# Altium schematic sheet 7segments.SchDoc
size A
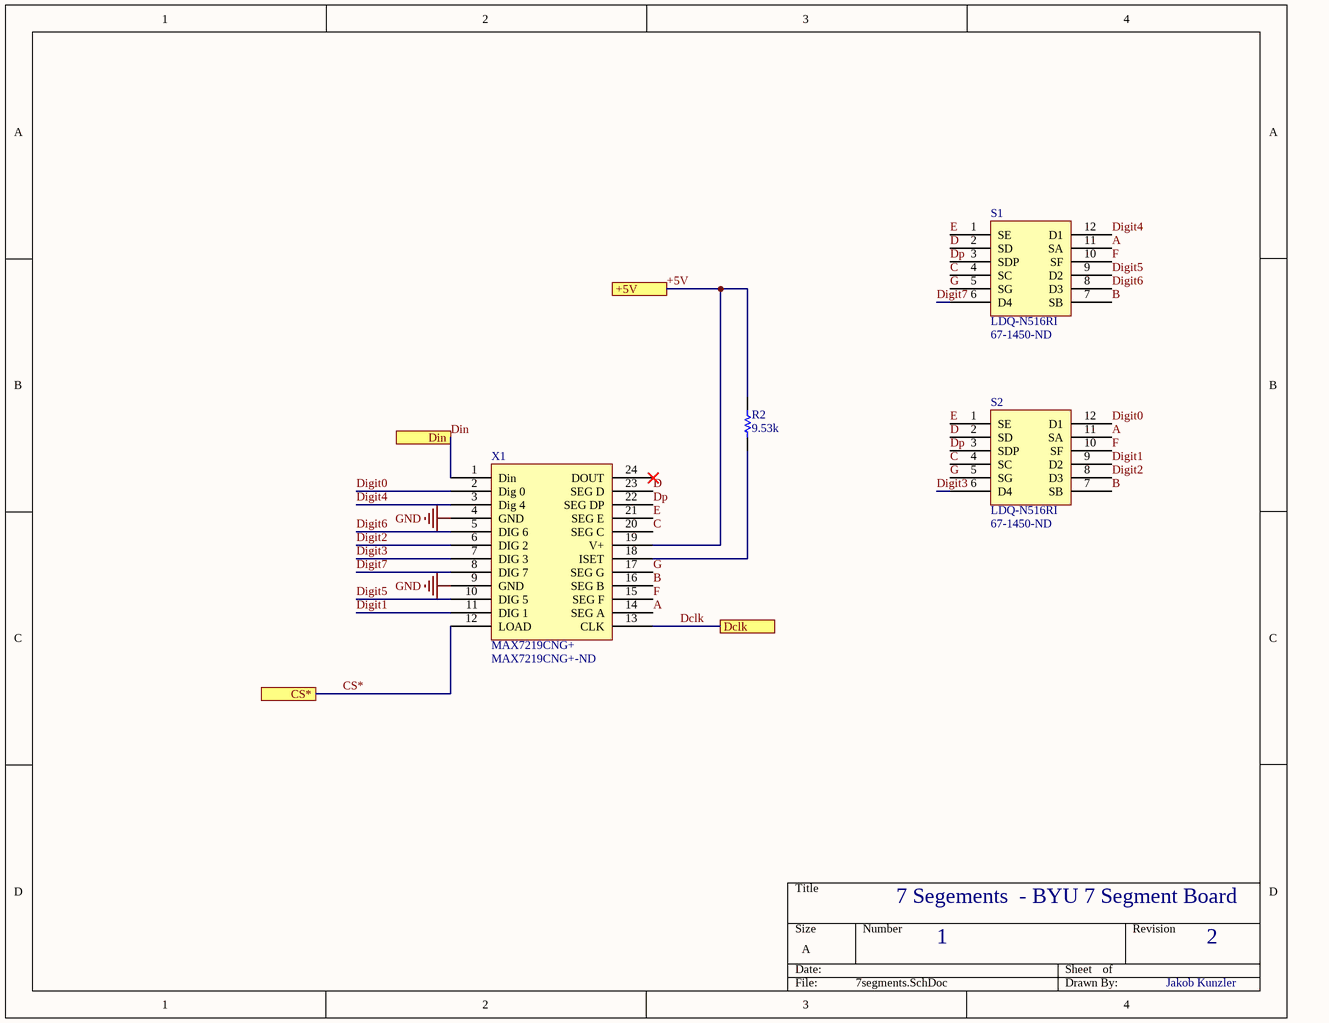
[diagram p0: 7segments.SchDoc]

## Parts
R2  9.53k  [Resistor Through Hole]
S1  LDQ-N516RI  Supplier Part Number 1: 67-1450-ND  [LDQ-516RI]
S2  LDQ-N516RI  Supplier Part Number 1: 67-1450-ND  [LDQ-516RI]
X1  MAX7219CNG+  Supplier Part Number 1: MAX7219CNG+-ND  [MAX7219]

## Ports
+5V, CS*, Dclk, Din

## Nets
GND: X1.4(GND) X1.9(GND)
+5V: R2.2 X1.19(V+) ; port +5V
A: S1.11(SA) S2.11(SA) X1.14(SEG_A)
B: S1.7(SB) S2.7(SB) X1.16(SEG_B)
C: S1.4(SC) S2.4(SC) X1.20(SEG_C)
CS*: X1.12(LOAD) ; port CS*
D: S1.2(SD) S2.2(SD) X1.23(SEG_D)
Dclk: X1.13(CLK) ; port Dclk
Digit0: S2.12(D1) X1.2(Dig_0)
Digit1: S2.9(D2) X1.11(DIG_1)
Digit2: S2.8(D3) X1.6(DIG_2)
Digit3: S2.6(D4) X1.7(DIG_3)
Digit4: S1.12(D1) X1.3(Dig_4)
Digit5: S1.9(D2) X1.10(DIG_5)
Digit6: S1.8(D3) X1.5(DIG_6)
Digit7: S1.6(D4) X1.8(DIG_7)
Din: X1.1(Din) ; port Din
Dp: S1.3(SDP) S2.3(SDP) X1.22(SEG_DP)
E: S1.1(SE) S2.1(SE) X1.21(SEG_E)
F: S1.10(SF) S2.10(SF) X1.15(SEG_F)
G: S1.5(SG) S2.5(SG) X1.17(SEG_G)
NetR2_1: R2.1 X1.18(ISET)

Not connected (* = marked no-connect by the designer): X1 24(DOUT)*

## Notes on the sheet
- 7 Segements  - BYU 7 Segment Board
- 1
- 2
- Jakob Kunzler

## Library data of the parts
R2 = Resistor_9.53k: MFR-25FBF52-9K53; ComponentLink1Description: 9.53KXBK-ND; ComponentLink1URL: https://www.digikey.com/product-detail/en/yageo/MFR-25FBF52-9K53/9.53KXBK-ND/13215; Supplier 1: Digi-Key
S1 S2 = SevenSegment: LED 7-SEG .56 QUAD S-RED CC MULT; ComponentLink1Description: 67-1450-ND; ComponentLink1URL: https://www.digikey.com/products/en?keywords=LDQ-N516RI; Supplier 1: Digi-Key
X1 = MAX7219: Serially Interfaced, 8-Digit LED Display Driver; ComponentLink1Description: MAX7219CNG+-ND; ComponentLink1URL: https://www.digikey.com/product-detail/en/maxim-integrated/MAX7219CNG/MAX7219CNG-ND/948191; Supplier 1: Digi-Key